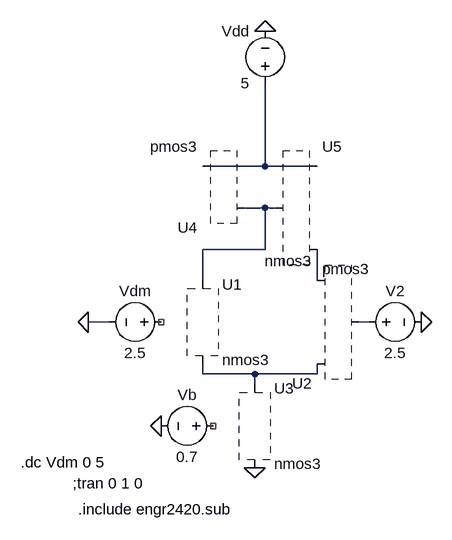
[diagram p0: schematic circuit.asc]
circuit.asc, the LTspice schematic file:
Version 4
SHEET 1 880 680
WIRE 272 -48 272 -176
WIRE 272 -48 176 -48
WIRE 352 -48 272 -48
WIRE 272 16 240 16
WIRE 288 16 272 16
WIRE 272 80 272 16
WIRE 272 80 176 80
WIRE 176 128 176 80
WIRE 352 128 352 80
WIRE 32 192 0 192
WIRE 432 192 416 192
WIRE 176 272 176 256
WIRE 256 272 176 272
WIRE 352 272 352 256
WIRE 352 272 256 272
WIRE 256 288 256 272
FLAG 256 416 0
FLAG 272 -256 0
FLAG 512 192 0
FLAG 0 192 0
FLAG 112 352 0
SYMBOL cktsym\\nmos3 176 192 R0
SYMATTR InstName U1
SYMBOL cktsym\\nmos3 352 192 R180
SYMATTR InstName U2
SYMBOL cktsym\\nmos3 256 352 R0
SYMATTR InstName U3
SYMBOL cktsym\\pmos3 176 16 R180
SYMATTR InstName U4
SYMBOL cktsym\\pmos3 352 16 R0
SYMATTR InstName U5
SYMBOL voltage 272 -160 R180
WINDOW 0 24 96 Left 2
WINDOW 3 24 16 Left 2
WINDOW 123 0 0 Left 0
WINDOW 39 0 0 Left 0
SYMATTR InstName Vdd
SYMATTR Value 5
SYMBOL voltage 128 192 R90
WINDOW 0 -32 56 VBottom 2
WINDOW 3 32 56 VTop 2
WINDOW 123 0 0 Left 0
WINDOW 39 0 0 Left 0
SYMATTR InstName Vdm
SYMATTR Value 2.5
SYMBOL voltage 416 192 R270
WINDOW 0 32 56 VTop 2
WINDOW 3 -32 56 VBottom 2
WINDOW 123 0 0 Left 0
WINDOW 39 0 0 Left 0
SYMATTR InstName V2
SYMATTR Value 2.5
SYMBOL voltage 208 352 R90
WINDOW 0 -32 56 VBottom 2
WINDOW 3 32 56 VTop 2
WINDOW 123 0 0 Left 0
WINDOW 39 0 0 Left 0
SYMATTR InstName Vb
SYMATTR Value 0.7
TEXT -24 440 Left 2 !;tran 0 1 0
TEXT -16 480 Left 2 !.include engr2420.sub
TEXT -104 408 Left 2 !.dc Vdm 0 5

The netlist it stands for:
* circuit.asc
* U1: nmos3 (symbol cktsym\nmos3 not available, pin order unknown); nets seen at it: N002, N005
* U2: nmos3 (symbol cktsym\nmos3 not available, pin order unknown); nets seen at it: N003, N004, N005
* U3: nmos3 (symbol cktsym\nmos3 not available, pin order unknown); nets seen at it: 0, N005
* U4: pmos3 (symbol cktsym\pmos3 not available, pin order unknown); nets seen at it: N001, N002
* U5: pmos3 (symbol cktsym\pmos3 not available, pin order unknown); nets seen at it: N001, N002, N003
Vdd N001 0 5
Vdm NC_01 0 2.5
V2 N004 0 2.5
Vb NC_02 0 0.7
;tran 0 1 0
.include engr2420.sub
.dc Vdm 0 5
.backanno
.end